# Altium schematic sheet Power.SchDoc
size A4
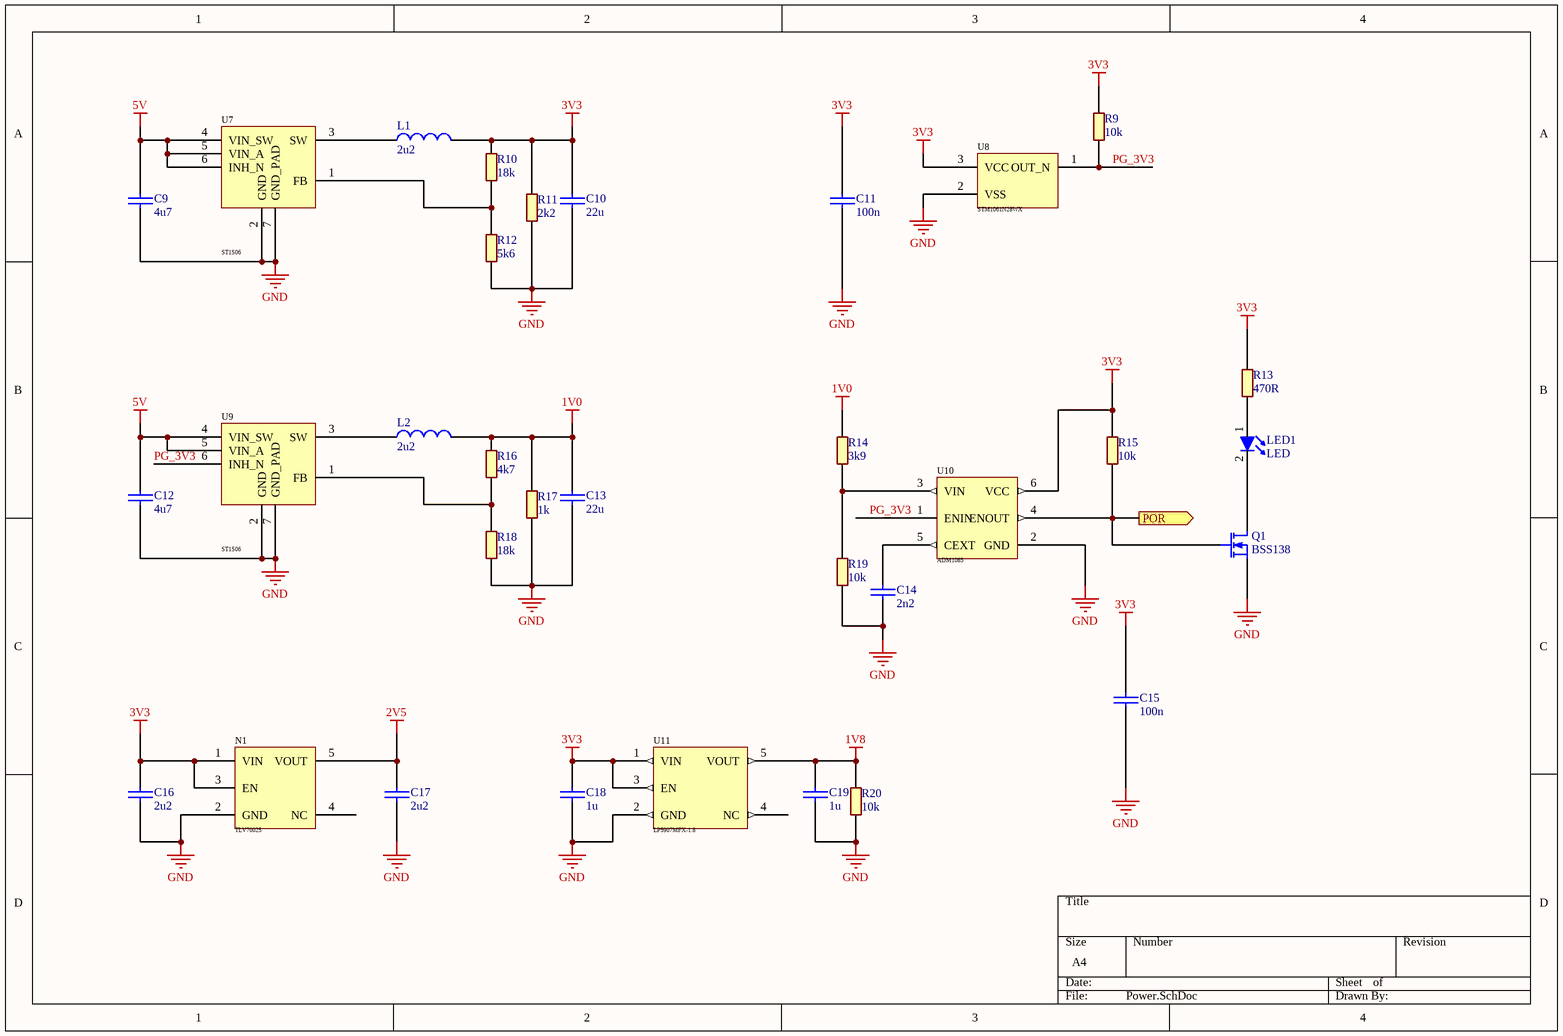
[diagram p0: Power.SchDoc]

## Parts
C9  4u7  [C0805]
C10  22u  [C1206]
C11  100n  [C0603]
C12  4u7  [C0805]
C13  22u  [C1206]
C14  2n2  [C0603]
C15  100n  [C0603]
C16  2u2  [C0805]
C17  2u2  [C0805]
C18  1u  [C0603]
C19  1u  [C0603]
L1  2u2  [L5.8X3.4]
L2  2u2  [L5.8X3.4]
LED1  LED  [LED0603]
N1  TLV70025  [SOT-23-5]
Q1  BSS138  [SOT-23]
R9  10k  [R0603]
R10  18k  [R0603]
R11  2k2  [R0603]
R12  5k6  [R0603]
R13  470R  [R0603]
R14  3k9  [R0603]
R15  10k  [R0603]
R16  4k7  [R0603]
R17  1k  [R0603]
R18  18k  [R0603]
R19  10k  [R0603]
R20  10k  [R0603]
U7  ST1S06
U8  STM1061N28WX  [SOT-23]
U9  ST1S06
U10  ADM1085  [SC70-6]
U11  LP5907MFX-1.8  [LC-SOT-23-5]

## Ports
POR (out)

## Nets
1V0: C13.1 L2.2 R14.1 R16.1 R17.1
1V8: C19.1 R20.1 U11.5(VOUT)
2V5: C17.1 N1.5(VOUT)
3V3: C10.1 C11.1 C15.1 C16.1 C18.1 L1.2 N1.1(VIN) N1.3(EN) R9.1 R10.1 R11.1 R13.1 R15.1 U8.3(VCC) U10.6(VCC) U11.1(VIN) U11.3(EN)
5V: C9.1 C12.1 U7.4(VIN_SW) U7.5(VIN_A) U7.6(INH_N) U9.4(VIN_SW) U9.5(VIN_A)
GND: C9.2 C10.2 C11.2 C12.2 C13.2 C14.2 C15.2 C16.2 C17.2 C18.2 C19.2 N1.2(GND) Q1.3(S) R11.2 R12.1 R17.2 R18.1 R19.2 R20.2 U7.2(GND) U7.7(GND_PAD) U8.2(VSS) U9.2(GND) U9.7(GND_PAD) U10.2(GND) U11.2(GND)
PG_3V3: R9.2 U8.1(OUT_N) U9.6(INH_N) U10.1(ENIN)
POR: Q1.2(G) R15.2 U10.4(ENOUT) ; port POR
NetC14_1: C14.1 U10.5(CEXT)
NetL1_1: L1.1 U7.3(SW)
NetL2_1: L2.1 U9.3(SW)
NetLED1_1: LED1.1 R13.2
NetLED1_2: LED1.2 Q1.1(D)
NetR10_2: R10.2 R12.2 U7.1(FB)
NetR14_2: R14.2 R19.1 U10.3(VIN)
NetR16_2: R16.2 R18.2 U9.1(FB)

Not connected (* = marked no-connect by the designer): N1 4(NC); U11 4(NC)

## Library data of the parts
C9-C19 = CAP: Capacitor
L1 L2 = L: Inductor
Q1 = MOSFET-N: N-Channel MOSFET; Published: 8-Jun-2000; LatestRevisionDate: 17-Jul-2002; LatestRevisionNote: Re-released for DXP Platform.; PackageVersion: 1995/1996; PackageReference: E3; Publisher: Altium Limited; PackageDescription: TO, Flat Index; 3 In-Line, Axial Leads; Body Dia. 4.6mm; Lead Dia. 0.5 mm (max)
R9-R20 = R: RES
U7 U9 = ST1S06: The ST1S06xx is a step down DC-DC converter  optimized for powering low-voltage digital core in  HDD applications and, generally, to replace the  high current linear solution when the power  dissipation may cause an high heating of the  application environment. It provides up to 1.5 A  over an input voltage range of 2.7 V to 6 V. An high  switching frequency (1.5 MHz) allows the use of  tiny surface-mount components: as well as the  resistor divider to set the output voltage value,  only an inductor and two capacitors are required